# Altium schematic sheet 41_LEDs.SchDoc
size A4; SheetNumber: 8; SheetTotal: 10
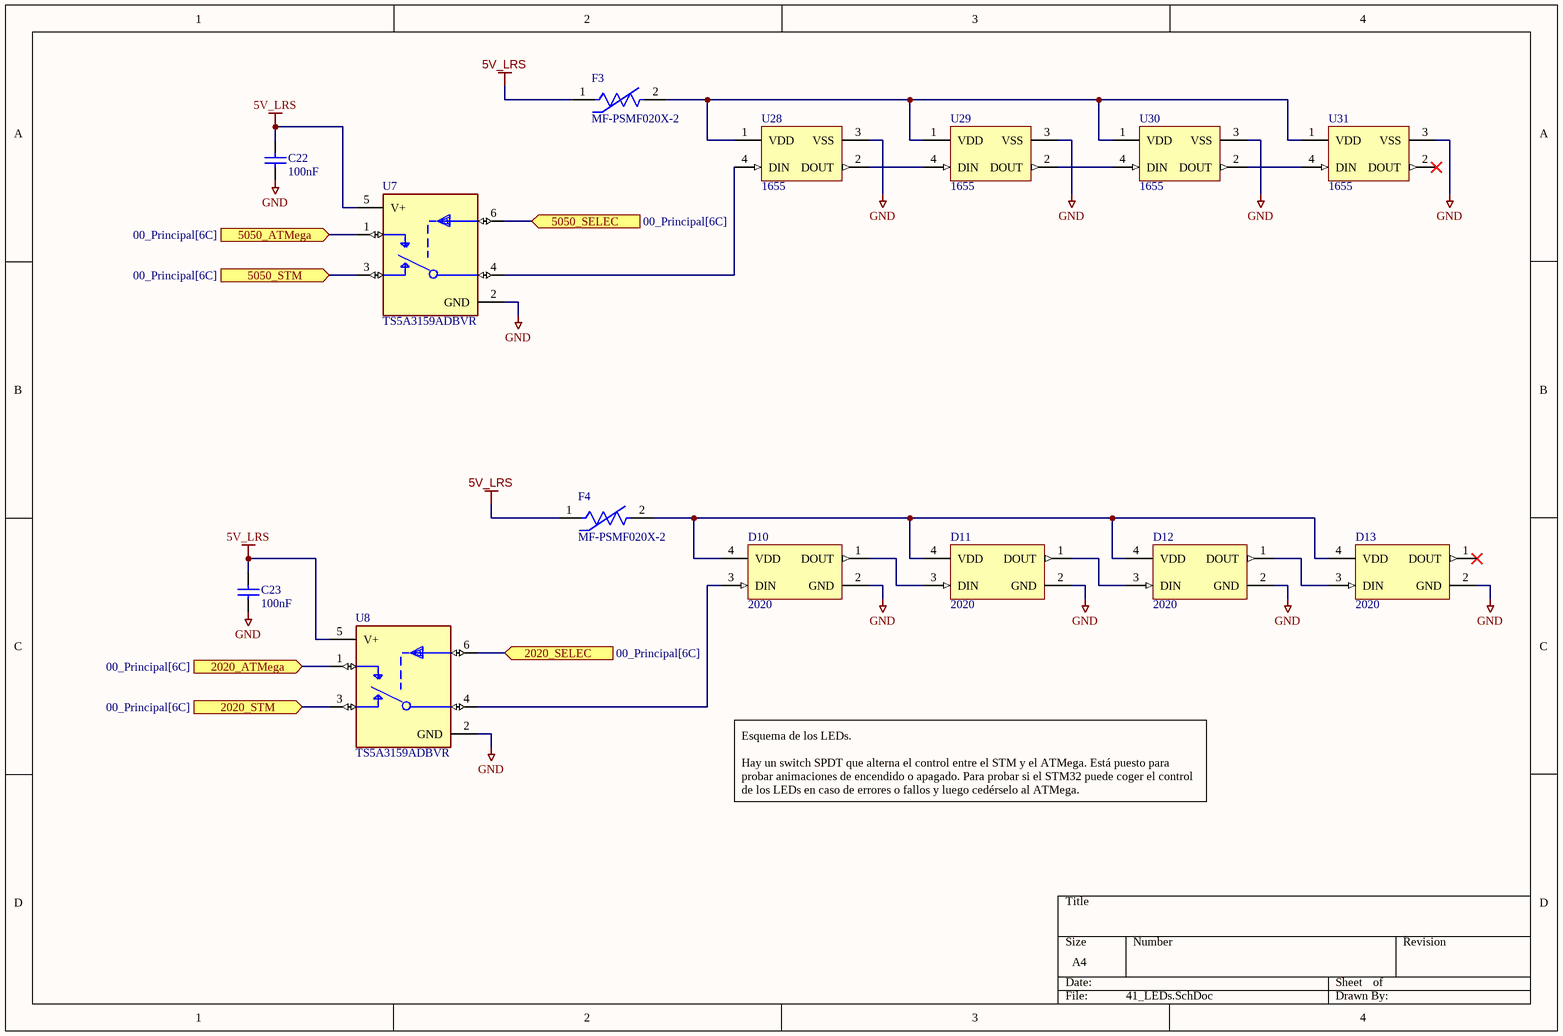
[diagram p0: 41_LEDs.SchDoc]

## Parts
C22  100nF  [CAPC1005X55X25NL05T05]
C23  100nF  [CAPC1005X55X25NL05T05]
D10  2020  [Adafruit 4684]  (no BOM)
D11  2020  [Adafruit 4684]  (no BOM)
D12  2020  [Adafruit 4684]  (no BOM)
D13  2020  [Adafruit 4684]  (no BOM)
F3  MF-PSMF020X-2  [FP-MF-PSMF-MFG]
F4  MF-PSMF020X-2  [FP-MF-PSMF-MFG]
U7  TS5A3159ADBVR  [FP-DBV0006A-MFG]
U8  TS5A3159ADBVR  [FP-DBV0006A-MFG]
U28  1655  [ADA-RGB-1655_V]  (no BOM)
U29  1655  [ADA-RGB-1655_V]  (no BOM)
U30  1655  [ADA-RGB-1655_V]  (no BOM)
U31  1655  [ADA-RGB-1655_V]  (no BOM)

## Ports
2020_ATMega (in, see 00_Principal[6C]), 2020_SELEC (in, see 00_Principal[6C]), 2020_STM (in, see 00_Principal[6C]), 5050_ATMega (in, see 00_Principal[6C]), 5050_SELEC (in, see 00_Principal[6C]), 5050_STM (in, see 00_Principal[6C])

## Nets
5V_LRS: C22.2 C23.2 F3.1 F4.1 U7.5(V+) U8.5(V+)
GND: C22.1 C23.1 D10.2(GND) D11.2(GND) D12.2(GND) D13.2(GND) U7.2(GND) U8.2(GND) U28.3(VSS) U29.3(VSS) U30.3(VSS) U31.3(VSS)
2020_ATMega: U8.1(NO) ; port 2020_ATMega
2020_SELEC: U8.6(IN) ; port 2020_SELEC
2020_STM: U8.3(NC) ; port 2020_STM
5050_ATMega: U7.1(NO) ; port 5050_ATMega
5050_SELEC: U7.6(IN) ; port 5050_SELEC
5050_STM: U7.3(NC) ; port 5050_STM
NetD10_1: D10.1(DOUT) D11.3(DIN)
NetD10_3: D10.3(DIN) U8.4(COM)
NetD10_4: D10.4(VDD) D11.4(VDD) D12.4(VDD) D13.4(VDD) F4.2
NetD11_1: D11.1(DOUT) D12.3(DIN)
NetD12_1: D12.1(DOUT) D13.3(DIN)
NetF3_2: F3.2 U28.1(VDD) U29.1(VDD) U30.1(VDD) U31.1(VDD)
NetU7_4: U7.4(COM) U28.4(DIN)
NetU28_2: U28.2(DOUT) U29.4(DIN)
NetU29_2: U29.2(DOUT) U30.4(DIN)
NetU30_2: U30.2(DOUT) U31.4(DIN)

Not connected (* = marked no-connect by the designer): D13 1(DOUT)*; U31 2(DOUT)*

## Notes on the sheet
- Esquema de los LEDs.
  Hay un switch SPDT que alterna el control entre el STM y el ATMega. Está puesto para probar animaciones de encendido o apagado. Para probar si el STM32 puede coger el control de los LEDs en caso de errores o fallos y luego cedérselo al ATMega.

## Library data of the parts
C22 C23 = CMP-2008-02030-1: Manufacturer: Vitramon; Part Number: VJ0402Y104KXJCW1BC
D10-D13 = NeoPixel Nano 2020: Adafruit Accessories NeoPixel Nano 2020 RGB LEDs WS2812B; Supplier 1: DigiKey; Supplier Part Number 1: 1528-4684-ND
F3 F4 = CMP-07400-000005-1: PTC RESET FUSE 9V 200MA 0805; Manufacturer: Bourns; Trip Current: 0.5A; Resistance: 0.65-3.5Ω; Current Rating: 40A; Value: 0.65-3.5Ω; Trip Time: 0.02s; Hold Current: 0.2A; ComponentLink2Description: Datasheet; Manufacturer Part Number: MF-PSMF020X-2; Height: 0.85mm; Ambient Temperature Range High: +85°C; Category: Fuse; Temperature Range Low: -40°C; ComponentLink2URL: https://www.bourns.com/docs/Product-Datasheets/mfpsmf.pdf; Temperature Range High: +85°C; RoHS: TRUE; Device Class L1: Circuit Protection; Device Class L3: unset; Package: MF-PSMF; Digikey Description: PTC RESET FUSE 9V 200MA 0805; Mouser Description: PTC Resettable Fuse 0.2A(hold) 0.5A(trip) 9V 40A 0.5W 0.02s 0.65Ohm SMD Solder Pad 0805 T/R; Voltage Rating: 9V; Automotive: No; Device Class L2: PTC Resettable Fuses; Temperature: -40°C to +85°C; Lead Free: Yes; Octopart: https://octopart.com/mf-psmf020x-2-bourns-7483437; Ambient Temperature Range Low: -40°C
U7 U8 = CMP-04892-000011-1: IC SWITCH SPDT SOT23-6; Manufacturer: Texas Instruments; Min Supply Voltage: 1.65V; Nominal Supply Current: 0.01-5uA; Number Of Circuits: 1; Mux Demux Ratio: 2:1; Standoff Height: 0mm; Max Supply Voltage: 5.5V; On State Resistance: 1Ω; Package: DBV0006A; Device Class L3: Analog Switches; Throw Configuration: SPDT; ComponentLink2Description: Datasheet; Digikey Description: IC SWITCH SPDT SOT23-6; Automotive: No; Temperature: -40°C to +85°C; Device Class L2: Interface ICs; Ambient Temperature Range Low: -40°C; Ipc Land Pattern Name: SOT95P280X145-6; ComponentLink2URL: http://www.ti.com/lit/ds/symlink/ts5a3159a.pdf; Octopart: https://octopart.com/ts5a3159adbvr-texas+instruments-443714; Lead Free: Yes; Height: 1.45mm; Temperature Range High: +85°C; Mouser Description: Analog Switch ICs SPDT ANALOG SWITCH; Device Class L1: Integrated Circuits (ICs); Manufacturer Part Number: TS5A3159ADBVR; Category: IC; RoHS: TRUE; Ambient Temperature Range High: +85°C; Temperature Range Low: -40°C
U28-U31 = CMP-2000-05026-1: Intelligent Control LED Integrated Light Source, 3.5 to 5.3 V, -25 to 80 degC, 4-Pin SMD, RoHS, Tape and Reel; Manufacturer: Adafruit-Industries-LLC; Number of LEDs: 10; Configuration: Discrete; Utilized LED: WS2812(5050); Datasheet URL: http://datasheet.octopart.com/ADA1655-Adafruit-Industries-datasheet-32028139.pdf; Series: Neopixel; Interface: -; Package Description: 4-Pin Surface Mount Device, Body 5 x 5 mm; Color: Red,Green,Blue(RGB); Category: Optoelectronics; Controller Type: -; Package Reference: 1655; Manufacturer URL: https://www.adafruit.com/; Mounting Type: SurfaceMount; Datasheet Version: May-13; Size / Dimension: 5.00mmLx5.00mmW; Family: Addressable,Specialty